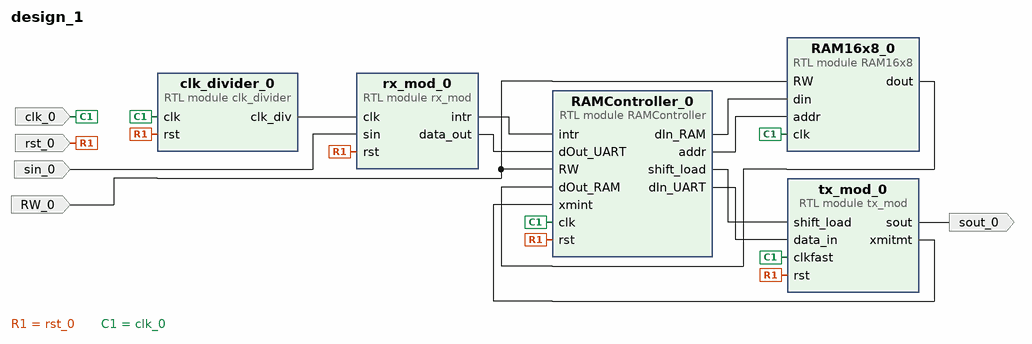
[diagram p0: block diagram of the top level]
# Vivado block design design_1, xc7z020clg400-1, Vivado 2018.3
create_bd_design design_1

create_bd_port -dir I -type clk clk_0
create_bd_port -dir I -type rst rst_0
create_bd_port -dir I RW_0
create_bd_port -dir I sin_0
create_bd_port -dir O sout_0

create_bd_cell -type module -reference clk_divider clk_divider_0
create_bd_cell -type module -reference rx_mod rx_mod_0
create_bd_cell -type module -reference tx_mod tx_mod_0
create_bd_cell -type module -reference RAMController RAMController_0
create_bd_cell -type module -reference RAM16x8 RAM16x8_0

# ---- connections ----

connect_bd_net -net rst_0_1 [get_bd_ports rst_0] \
  [get_bd_pins clk_divider_0/rst] [get_bd_pins rx_mod_0/rst] [get_bd_pins tx_mod_0/rst] [get_bd_pins RAMController_0/rst]
connect_bd_net -net sin_0_1 [get_bd_ports sin_0] [get_bd_pins rx_mod_0/sin]
connect_bd_net [get_bd_pins tx_mod_0/sout] [get_bd_ports sout_0]
connect_bd_net -net RW_0_1 [get_bd_ports RW_0] [get_bd_pins RAMController_0/RW] [get_bd_pins RAM16x8_0/RW]
connect_bd_net [get_bd_pins rx_mod_0/intr] [get_bd_pins RAMController_0/intr]
connect_bd_net [get_bd_pins tx_mod_0/xmitmt] [get_bd_pins RAMController_0/xmint]
connect_bd_net [get_bd_pins RAMController_0/shift_load] [get_bd_pins tx_mod_0/shift_load]
connect_bd_net [get_bd_pins rx_mod_0/data_out] [get_bd_pins RAMController_0/dOut_UART]
connect_bd_net [get_bd_pins RAMController_0/dIn_UART] [get_bd_pins tx_mod_0/data_in]
connect_bd_net [get_bd_pins RAMController_0/dIn_RAM] [get_bd_pins RAM16x8_0/din]
connect_bd_net [get_bd_pins RAMController_0/addr] [get_bd_pins RAM16x8_0/addr]
connect_bd_net [get_bd_pins RAM16x8_0/dout] [get_bd_pins RAMController_0/dOut_RAM]
connect_bd_net [get_bd_ports clk_0] \
  [get_bd_pins clk_divider_0/clk] [get_bd_pins tx_mod_0/clkfast] [get_bd_pins RAM16x8_0/clk] \
  [get_bd_pins RAMController_0/clk]
connect_bd_net [get_bd_pins clk_divider_0/clk_div] [get_bd_pins rx_mod_0/clk]

validate_bd_design
save_bd_design
